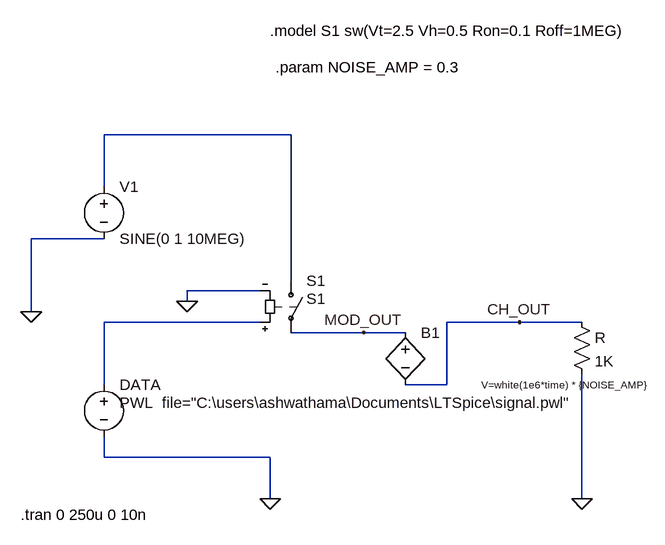
[diagram p0: schematic Modulator.asc]
Modulator.asc, the LTspice schematic file:
Version 4.1
SHEET 1 976 680
WIRE 368 -48 80 -48
WIRE 80 32 80 -48
WIRE 80 112 -32 112
WIRE 368 176 368 -48
WIRE 320 192 208 192
WIRE 208 208 208 192
WIRE -32 224 -32 112
WIRE 320 240 80 240
WIRE 720 240 608 240
WIRE 816 240 720 240
WIRE 480 256 368 256
WIRE 544 256 480 256
WIRE 80 336 80 240
WIRE 608 336 608 240
WIRE 608 336 544 336
WIRE 80 448 80 416
WIRE 336 448 80 448
WIRE 336 512 336 448
WIRE 816 512 816 320
FLAG 336 512 0
FLAG -32 224 0
FLAG 208 208 0
FLAG 480 256 MOD_OUT
FLAG 720 240 CH_OUT
FLAG 816 512 0
SYMBOL voltage 80 16 R0
WINDOW 123 0 0 Left 0
WINDOW 39 0 0 Left 0
SYMATTR InstName V1
SYMATTR Value SINE(0 1 10MEG)
SYMBOL voltage 80 320 R0
WINDOW 123 0 0 Left 0
WINDOW 39 0 0 Left 0
WINDOW 3 24 44 Left 2
SYMATTR Value PWL  file="C:\users\ashwathama\Documents\LTSpice\signal.pwl"
SYMATTR InstName DATA
SYMBOL sw 368 160 R0
WINDOW 3 24 44 Left 2
SYMATTR Value S1
SYMATTR InstName S1
SYMBOL res 800 224 R0
SYMATTR InstName R
SYMATTR Value 1K
SYMBOL bv 544 240 R0
WINDOW 3 243 96 Center 1
SYMATTR InstName B1
SYMATTR Value V=white(1e6*time) * {NOISE_AMP}
TEXT -48 536 Left 2 !.tran 0 250u 0 10n
TEXT 336 -208 Left 2 !.model S1 sw(Vt=2.5 Vh=0.5 Ron=0.1 Roff=1MEG)
TEXT 344 -152 Left 2 !.param NOISE_AMP = 0.3

The netlist it stands for:
* Modulator.asc
V1 N001 0 SINE(0 1 10MEG)
V§DATA N002 0 PWL  file="C:\users\ashwathama\Documents\LTSpice\signal.pwl"
S1 N001 MOD_OUT N002 0 S1
R CH_OUT 0 1K
B1 MOD_OUT CH_OUT V=white(1e6*time) * {NOISE_AMP}
.tran 0 250u 0 10n
.model S1 sw(Vt=2.5 Vh=0.5 Ron=0.1 Roff=1MEG)
.param NOISE_AMP = 0.3
.backanno
.end